# Altium project ESP32_CAN_V2.PrjPcb
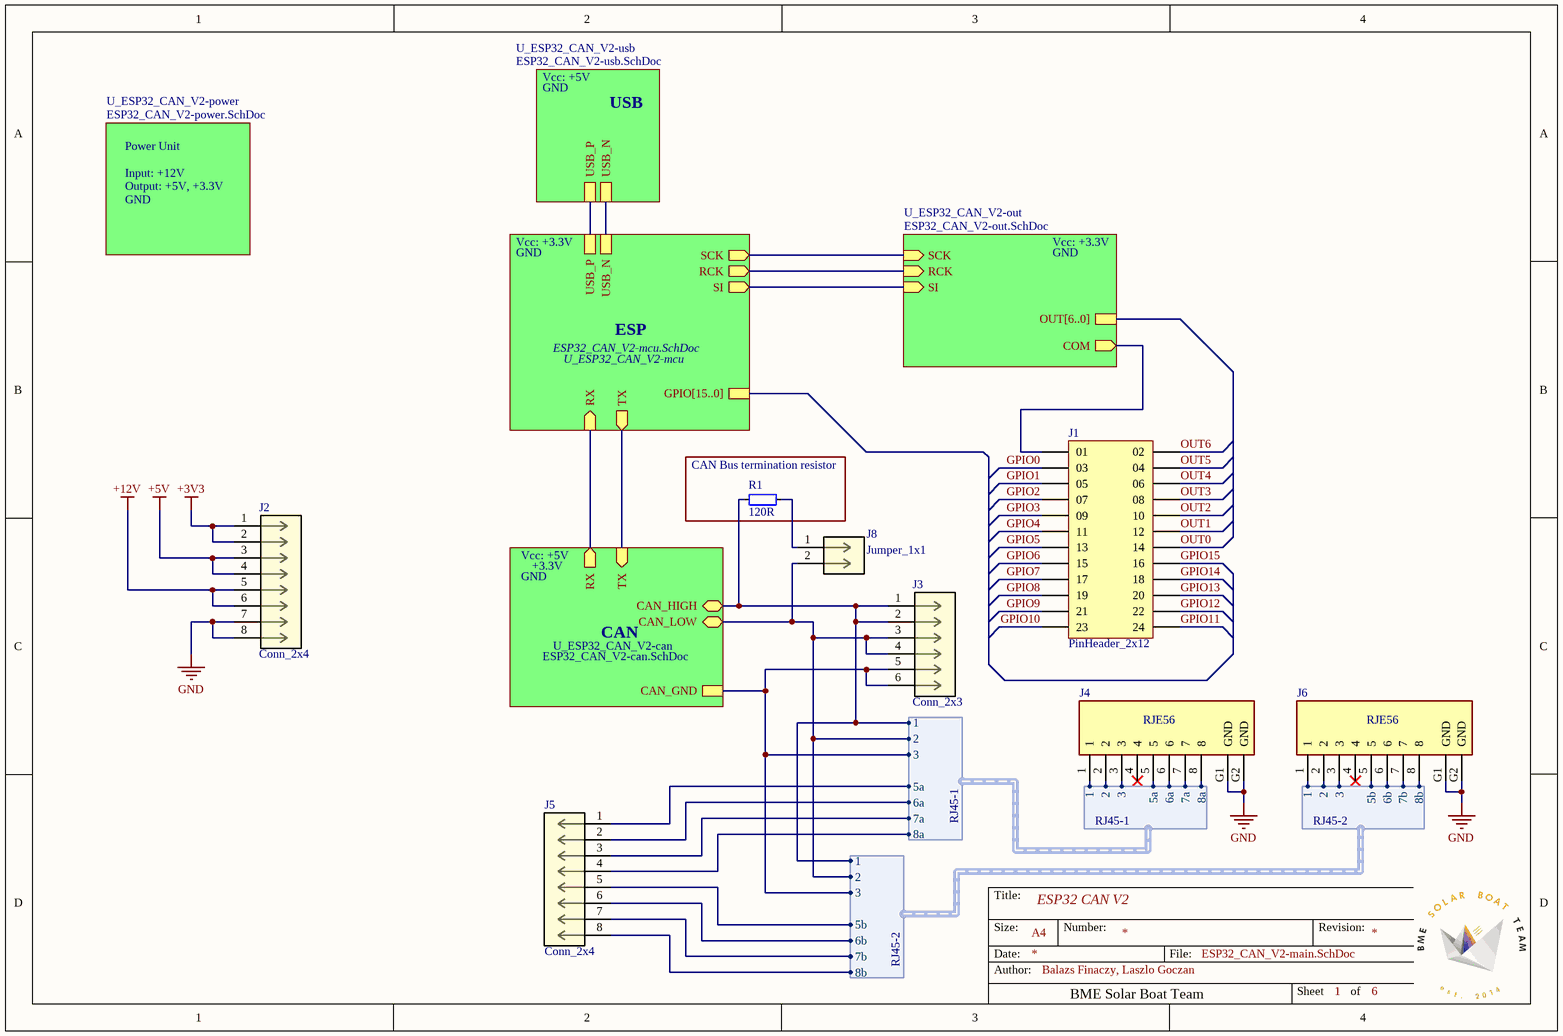
[diagram p0: ESP32_CAN_V2-main.SchDoc]
6 sheets, 87 parts. Net scope: hierarchical (ports join the sheet entries above them; power ports are global).
Board file: ESP32_CAN_V2.2.PcbDoc
Sheets:
  ESP32_CAN_V2-main.SchDoc
    U_ESP32_CAN_V2-mcu = ESP32_CAN_V2-mcu.SchDoc
    U_ESP32_CAN_V2-usb = ESP32_CAN_V2-usb.SchDoc
    U_ESP32_CAN_V2-out = ESP32_CAN_V2-out.SchDoc
    U_ESP32_CAN_V2-power = ESP32_CAN_V2-power.SchDoc
    U_ESP32_CAN_V2-can = ESP32_CAN_V2-can.SchDoc

## Sheet ESP32_CAN_V2-main.SchDoc: ESP32 CAN V2
size A4; DrawnBy: Balazs Finaczy, Laszlo Goczan; SheetNumber: 1; SheetTotal: 6

### Parts
J1  PinHeader_2x12  [AMPHENOL_10129381-924003BLF]
J2  Conn_2x4  [CONN_10129381-X08002XLF_AMP]
J3  Conn_2x3  [CONN_10129381-X08002XLF_AMP]
J4  RJE56  [AMPHENOL_RJE561881410]
J5  Conn_2x4  [CONN_10129381-X08002XLF_AMP]
J6  RJE56  [AMPHENOL_RJE561881410]
J8  Jumper_1x1  [CON2_1X2_TU_TSW]
R1  120R  [R0603]

### Blocks framed on the sheet
CAN Bus termination resistor: R1

### Sub-sheets
U_ESP32_CAN_V2-can = ESP32_CAN_V2-can.SchDoc: RX (out), TX (in), CAN_HIGH (bidir), CAN_LOW (bidir), CAN_GND
U_ESP32_CAN_V2-mcu = ESP32_CAN_V2-mcu.SchDoc: TX (out), RX (in), SCK (out), RCK (out), SI (out), GPIO[15..0], USB_N, USB_P
U_ESP32_CAN_V2-out = ESP32_CAN_V2-out.SchDoc: SI (in), RCK (in), SCK (in), COM (out), OUT[6..0]
U_ESP32_CAN_V2-power = ESP32_CAN_V2-power.SchDoc: no entries
U_ESP32_CAN_V2-usb = ESP32_CAN_V2-usb.SchDoc: USB_N, USB_P

### Harnesses
RJ45-1: 1, 2, 3, 5a, 6a, 7a, 8a
RJ45-2: 1, 2, 3, 5b, 6b, 7b, 8b

### Nets
+3V3: J2.1 J2.2
+5V: J2.3 J2.4
+12V: J2.5 J2.6
GND: J2.7 J2.8 J4.G1(GND) J4.G2(GND) J6.G1(GND) J6.G2(GND)
CAN_GND: J3.5 J3.6 J4.3 J6.3 ; sheet U_ESP32_CAN_V2-can/CAN_GND, harness RJ45-1.3, harness RJ45-2.3
GPIO0: J1.03  [project net GPIO0_1]
GPIO1: J1.05  [project net GPIO1_1]
GPIO2: J1.07  [project net GPIO2_1]
GPIO3: J1.09  [project net GPIO3_1]
GPIO4: J1.11  [project net GPIO4_1]
GPIO5: J1.13  [project net GPIO5_1]
GPIO6: J1.15  [project net GPIO6_1]
GPIO7: J1.17  [project net GPIO7_1]
GPIO8: J1.19  [project net GPIO8_1]
GPIO9: J1.21  [project net GPIO9_1]
GPIO10: J1.23  [project net GPIO10_1]
GPIO11: J1.24  [project net GPIO11_1]
GPIO12: J1.22  [project net GPIO12_1]
GPIO13: J1.20  [project net GPIO13_1]
GPIO14: J1.18  [project net GPIO14_1]
GPIO15: J1.16  [project net GPIO15_1]
OUT0: J1.14  [project net OUT0_1]
OUT1: J1.12  [project net OUT1_1]
OUT2: J1.10  [project net OUT2_1]
OUT3: J1.08  [project net OUT3_1]
OUT4: J1.06  [project net OUT4_1]
OUT5: J1.04  [project net OUT5_1]
OUT6: J1.02  [project net OUT6_1]
RCK: sheet U_ESP32_CAN_V2-mcu/RCK, sheet U_ESP32_CAN_V2-out/RCK
RX: sheet U_ESP32_CAN_V2-mcu/RX, sheet U_ESP32_CAN_V2-can/RX
SI: sheet U_ESP32_CAN_V2-mcu/SI, sheet U_ESP32_CAN_V2-out/SI
TX: sheet U_ESP32_CAN_V2-mcu/TX, sheet U_ESP32_CAN_V2-can/TX
USB_N: sheet U_ESP32_CAN_V2-mcu/USB_N, sheet U_ESP32_CAN_V2-usb/USB_N
USB_P: sheet U_ESP32_CAN_V2-mcu/USB_P, sheet U_ESP32_CAN_V2-usb/USB_P
NetC23_2: J3.1 J3.2 J4.1 J6.1 R1.1 ; sheet U_ESP32_CAN_V2-can/CAN_HIGH, harness RJ45-1.1, harness RJ45-2.1
NetC24_1: J3.3 J3.4 J4.2 J6.2 J8.2 ; sheet U_ESP32_CAN_V2-can/CAN_LOW, harness RJ45-1.2, harness RJ45-2.2
NetD3_1: J1.01 ; sheet U_ESP32_CAN_V2-out/COM
NetIC1_11: sheet U_ESP32_CAN_V2-mcu/SCK, sheet U_ESP32_CAN_V2-out/SCK
NetJ4_5: J4.5 J5.1 ; harness RJ45-1.5a
NetJ4_6: J4.6 J5.2 ; harness RJ45-1.6a
NetJ4_7: J4.7 J5.3 ; harness RJ45-1.7a
NetJ4_8: J4.8 J5.4 ; harness RJ45-1.8a
NetJ5_5: J5.5 J6.5 ; harness RJ45-2.5b
NetJ5_6: J5.6 J6.6 ; harness RJ45-2.6b
NetJ5_7: J5.7 J6.7 ; harness RJ45-2.7b
NetJ5_8: J5.8 J6.8 ; harness RJ45-2.8b
NetJ8_1: J8.1 R1.2

Not connected (* = marked no-connect by the designer): J4 4*; J6 4*

### Notes on the sheet
- Vcc: +5V
- GND
- USB
- Power Unit
- Input: +12V
- Output: +5V, +3.3V
- Vcc: +3.3V
- ESP
- +3.3V
- CAN
- Title:
- Size:
- Date:
- Author:
- A4
- Number:
- BME Solar Boat Team
- File:
- Revision:
- Sheet
- of

### Library data of the parts
J1 = PinHeader_2x12: MF: {'manufacturer': u'Amphenol ICC (FCI)'}; MP: 10129381-924003BLF; Package: None; Price: None; Value: *; Availability: Unavailable
J2 J5 = PinHeader_2x4: Manufacturer_Name: Amphenol ICC; Manufacturer_Part_Number: 10129381-908002BLF; Copyright: Copyright (C) 2026 Ultra Librarian. All rights reserved.; RefDes: RefDes; Type: Type
J3 = PinHeader_2x3_1: Manufacturer_Name: Amphenol ICC; Manufacturer_Part_Number: 10129381-908002BLF; Copyright: Copyright (C) 2026 Ultra Librarian. All rights reserved.; RefDes: RefDes; Type: Type
J4 J6 = RJE561881410: Modular Jack - Right Angle, Input Output Connectors 8P8C, Without Shield .; MF: Amphenol Commercial Products; Reference: RJE56-188-1410; SnapEDA_Link: https://www.snapeda.com/parts/RJE561881410/Amphenol/view-part/?ref=snap; Package: None; Value: *; MP: RJE561881410; Check_prices: https://www.snapeda.com/parts/RJE561881410/Amphenol/view-part/?ref=eda; Type: RJE56; Supplier: Farnell
J8 = TSW-102-08-T-S: No Description Available; Manufacturer_Name: Samtec Inc; Copyright: Copyright (C) 2026 Ultra Librarian. All rights reserved.; Manufacturer_Part_Number: TSW-102-08-T-S; RefDes: RefDes; Type: Type
R1 = R

## Sheet ESP32_CAN_V2-mcu.SchDoc: ESP32_CAN_V2 - ESP unit
size A4; DrawnBy: Balazs Finaczy, Laszlo Goczan; SheetNumber: 2; SheetTotal: 6
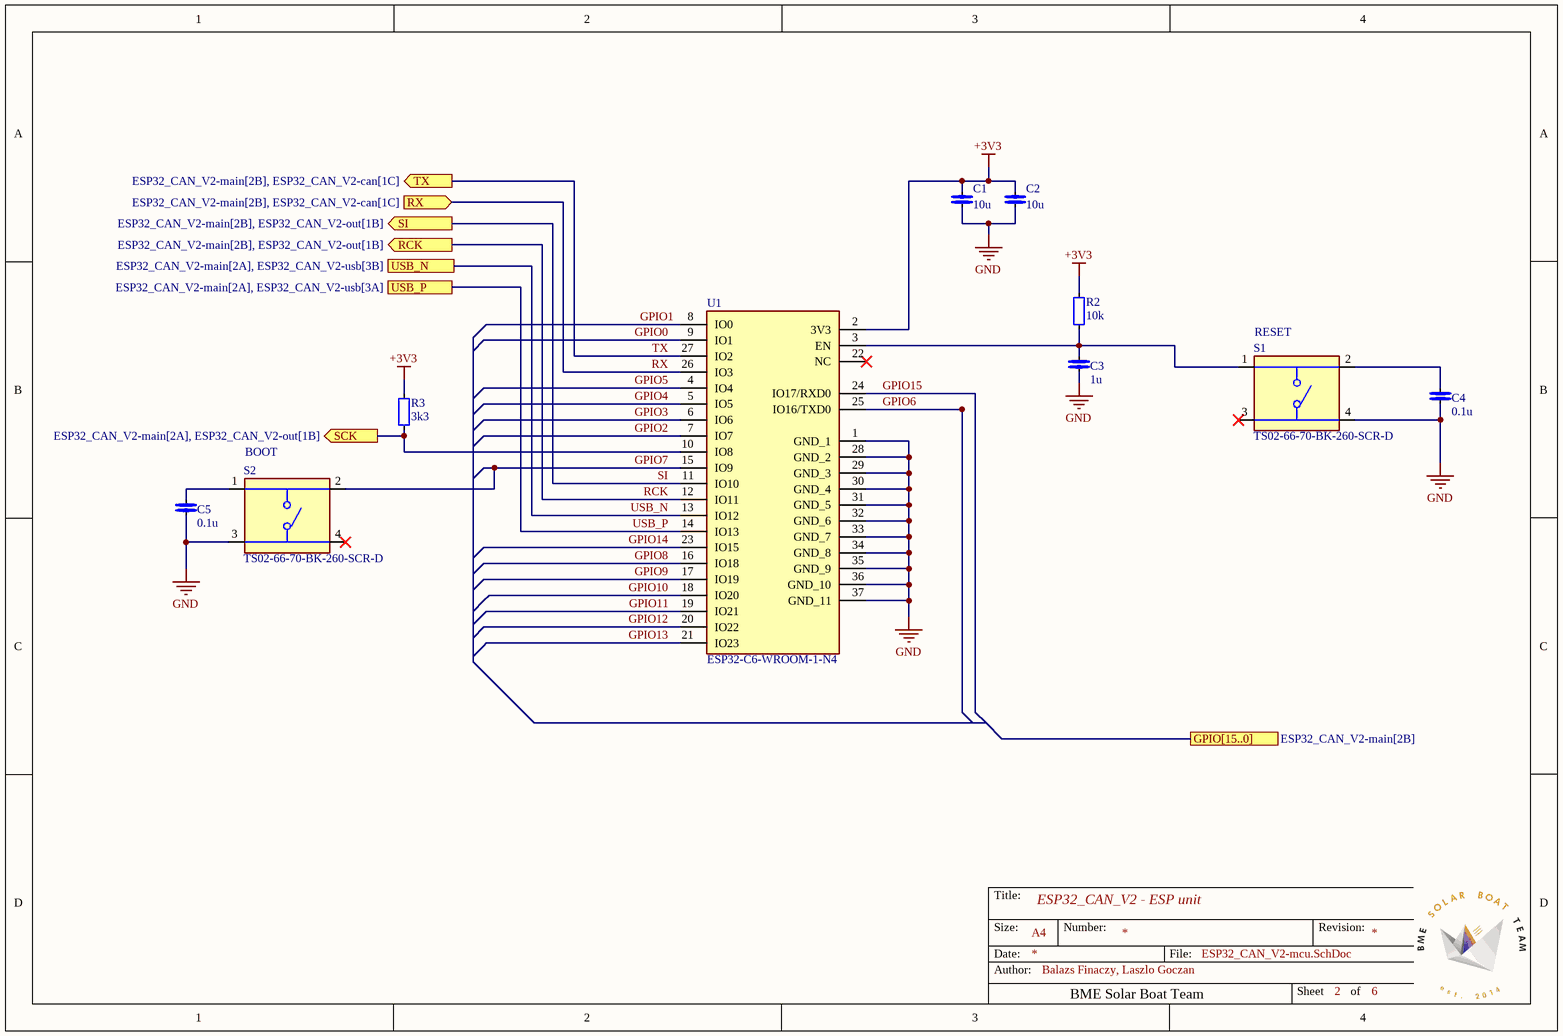
[diagram p1: ESP32_CAN_V2-mcu.SchDoc]

### Parts
C1  10u  [C0805]
C2  10u  [C0805]
C3  1u  [C0603]
C4  0.1u  [C0603]
C5  0.1u  [C0603]
R2  10k  [R0603]
R3  3k3  [R0603]
S1  TS02-66-70-BK-260-SCR-D  [SW_TS02-66-70-BK-260-SCR-D]
S2  TS02-66-70-BK-260-SCR-D  [SW_TS02-66-70-BK-260-SCR-D]
U1  ESP32-C6-WROOM-1-N4  [ESP32C6WROOM1N4]

### Ports
GPIO[15..0] (see ESP32_CAN_V2-main[2B]), RCK (out, see ESP32_CAN_V2-main[2B], ESP32_CAN_V2-out[1B]), RX (in, see ESP32_CAN_V2-main[2B], ESP32_CAN_V2-can[1C]), SCK (out, see ESP32_CAN_V2-main[2A], ESP32_CAN_V2-out[1B]), SI (out, see ESP32_CAN_V2-main[2B], ESP32_CAN_V2-out[1B]), TX (out, see ESP32_CAN_V2-main[2B], ESP32_CAN_V2-can[1C]), USB_N (see ESP32_CAN_V2-main[2A], ESP32_CAN_V2-usb[3B]), USB_P (see ESP32_CAN_V2-main[2A], ESP32_CAN_V2-usb[3A])

### Nets
+3V3: C1.2 C2.2 R2.2 R3.2 U1.2(3V3)
GND: C1.1 C2.1 C3.1 C4.1 C5.1 S1.4 S2.3 U1.1(GND_1) U1.28(GND_2) U1.29(GND_3) U1.30(GND_4) U1.31(GND_5) U1.32(GND_6) U1.33(GND_7) U1.34(GND_8) U1.35(GND_9) U1.36(GND_10) U1.37(GND_11)
GPIO0: U1.9(IO1)  [project net GPIO0_2]
GPIO1: U1.8(IO0)  [project net GPIO1_2]
GPIO2: U1.7(IO7)  [project net GPIO2_2]
GPIO3: U1.6(IO6)  [project net GPIO3_2]
GPIO4: U1.5(IO5)  [project net GPIO4_2]
GPIO5: U1.4(IO4)  [project net GPIO5_2]
GPIO6: U1.25(IO16/TXD0)  [project net GPIO6_2]
GPIO7: S2.2 U1.15(IO9)  [project net GPIO7_2]
GPIO8: U1.16(IO18)  [project net GPIO8_2]
GPIO9: U1.17(IO19)  [project net GPIO9_2]
GPIO10: U1.18(IO20)  [project net GPIO10_2]
GPIO11: U1.19(IO21)  [project net GPIO11_2]
GPIO12: U1.20(IO22)  [project net GPIO12_2]
GPIO13: U1.21(IO23)  [project net GPIO13_2]
GPIO14: U1.23(IO15)  [project net GPIO14_2]
GPIO15: U1.24(IO17/RXD0)  [project net GPIO15_2]
RCK: U1.12(IO11) ; port RCK
RX: U1.26(IO3) ; port RX
SI: U1.11(IO10) ; port SI
TX: U1.27(IO2) ; port TX
USB_N: U1.13(IO12) ; port USB_N
USB_P: U1.14(IO13) ; port USB_P
NetC3_2: C3.2 R2.1 S1.1 U1.3(EN)
NetC4_2: C4.2 S1.2
NetC5_2: C5.2 S2.1
NetIC1_11: R3.1 U1.10(IO8) ; port SCK

Not connected (* = marked no-connect by the designer): S1 3*; S2 4*; U1 22(NC)*

### Notes on the sheet
- (near S1) RESET
- (near S2) BOOT
- Title:
- Size:
- Date:
- Author:
- A4
- Number:
- BME Solar Boat Team
- File:
- Revision:
- Sheet
- of

### Library data of the parts
C1-C5 = C
R2 R3 = R
S1 S2 = TS02-66-70-BK-260-SCR-D: 6 x 6 mm, 7 mm Actuator Height, 260 gf, Black, Short Crimped, Through Hole, SPST, Tactile Switch; MF: Same Sky; SnapEDA_Link: https://www.snapeda.com/parts/TS02-66-70-BK-260-SCR-D/Same+Sky/view-part/?ref=snap; Package: None; Value: *; MP: TS02-66-70-BK-260-SCR-D; Check_prices: https://www.snapeda.com/parts/TS02-66-70-BK-260-SCR-D/Same+Sky/view-part/?ref=eda
U1 = ESP32-C6-WROOM-1-N4_reorder: 802.15.4, Bluetooth, WiFi Bluetooth v5.0, Zigbee Transceiver Module 2.4GHz PCB Trace Surface Mount; Manufacturer_Name: Espressif Systems; Geometry.Height: 3.25mm; Mouser Part Number: 356-ESP32C6WROOM1N4; Mouser Price/Stock: https://www.mouser.co.uk/ProductDetail/Espressif-Systems/ESP32-C6-WROOM-1-N4?qs=8Wlm6%252BaMh8R1JRAtXlt87w%3D%3D; Manufacturer_Part_Number: ESP32-C6-WROOM-1-N4; Datasheet Link: https://www.espressif.com/sites/default/files/documentation/esp32-c6-wroom-1_wroom-1u_datasheet_en.pdf

## Sheet ESP32_CAN_V2-usb.SchDoc: ESP32_CAN_V2 - USB unit
size A4; DrawnBy: Balazs Finaczy, Laszlo Goczan; SheetNumber: 3; SheetTotal: 6
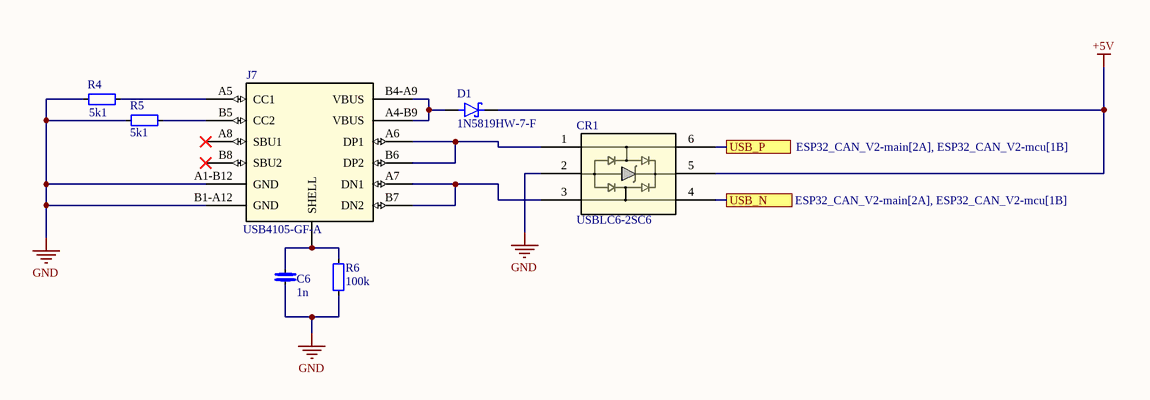
[diagram p2: ESP32_CAN_V2-usb.SchDoc]

### Parts
C6  1n  [C0603]
CR1  USBLC6-2SC6  [SOT23-6L_STM]
D1  1N5819HW-7-F  [SOD3715X145N]
J7  USB4105-GF-A  [USB4105_GCT]
R4  5k1  [R0603]
R5  5k1  [R0603]
R6  100k  [R0603]

### Ports
USB_N (see ESP32_CAN_V2-main[2A], ESP32_CAN_V2-mcu[1B]), USB_P (see ESP32_CAN_V2-main[2A], ESP32_CAN_V2-mcu[1B])

### Nets
+5V: CR1.5 D1.C(K)
GND: C6.1 CR1.2 J7.A1-B12(GND) J7.B1-A12(GND) R4.1 R5.1 R6.1
USB_N: CR1.4 ; port USB_N
USB_P: CR1.6 ; port USB_P
NetC6_2: C6.2 J7.SHELL R6.2
NetCR1_1: CR1.1 J7.A6(DP1) J7.B6(DP2)
NetCR1_3: CR1.3 J7.A7(DN1) J7.B7(DN2)
NetD1_A: D1.A J7.A4-B9(VBUS) J7.B4-A9(VBUS)
NetJ7_A5: J7.A5(CC1) R4.2
NetJ7_B5: J7.B5(CC2) R5.2

Not connected (* = marked no-connect by the designer): J7 A8(SBU1)* B8(SBU2)*

### Notes on the sheet
- Title:
- Size:
- Date:
- Author:
- A4
- Number:
- BME Solar Boat Team
- File:
- Revision:
- Sheet
- of

### Library data of the parts
C6 = C
CR1 = USBLC6-2SC6: ESD Protection for USB 2.0 High Speed; Manufacturer_Name: STMicroelectronics; Copyright: Copyright (C) 2025 Ultra Librarian. All rights reserved.; Manufacturer_Part_Number: USBLC6-2SC6; RefDes: RefDes; Type: Type
D1 = 1N5819HW-7-F: Diode Schottky 40 V 1A Surface Mount SOD-123; MF: Diodes Inc.; Value: *; SnapEDA_Link: https://www.snapeda.com/parts/1N5819HW-7-F/Diodes+Inc./view-part/?ref=snap; Purchase-URL: https://pricing.snapeda.com/search/part/1N5819HW-7-F/?ref=eda; Availability: In Stock; Price: None; Package: SOD-123 Fairchild Semiconductor; Check_prices: https://www.snapeda.com/parts/1N5819HW-7-F/Diodes+Inc./view-part/?ref=eda; MP: 1N5819HW-7-F
J7 = USB4105-GF-A: Description; Manufacturer_Name: Global Connector Technology; Copyright: Copyright (C) 2025 Ultra Librarian. All rights reserved.; Manufacturer_Part_Number: USB4105-GF-A; RefDes: RefDes; Type: Type
R4-R6 = R

## Sheet ESP32_CAN_V2-out.SchDoc: ESP32_CAN_V2 - OUT module
size A4; DrawnBy: Balazs Finaczy, Laszlo Goczan; SheetNumber: 4; SheetTotal: 6
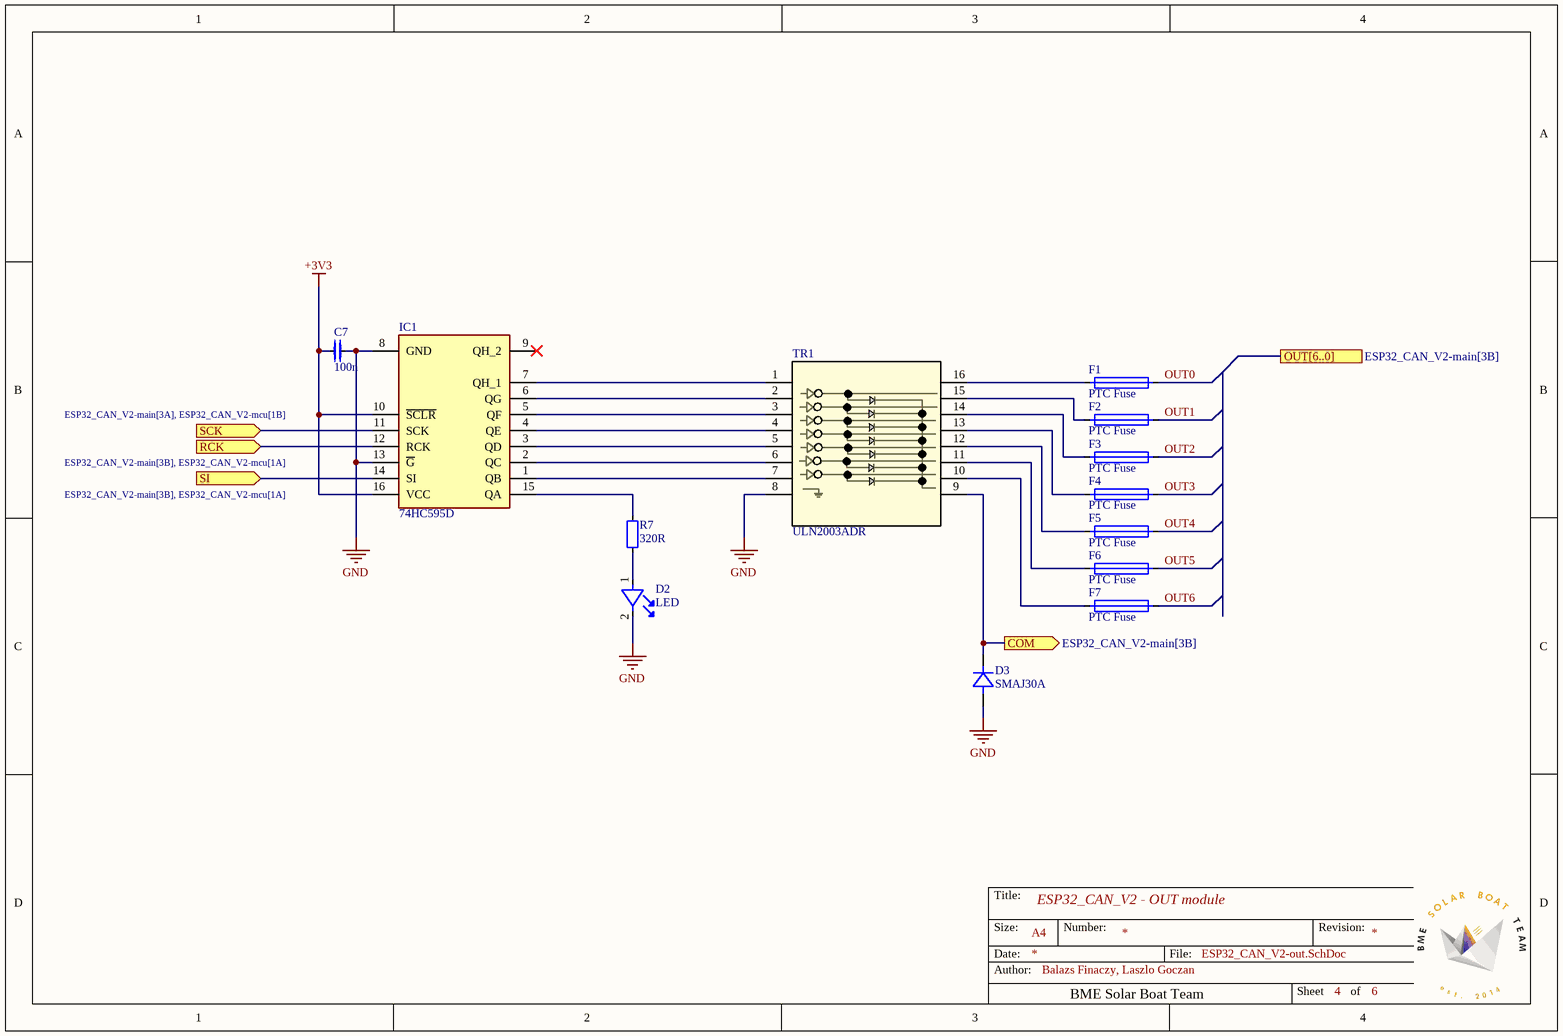
[diagram p3: ESP32_CAN_V2-out.SchDoc]

### Parts
C7  100n  [C0603]
D2  LED  [LED]
D3  SMAJ30A  [SMASeries_LTF]
F1  PTC Fuse  [PTSAHT120624V050]
F2  PTC Fuse  [PTSAHT120624V050]
F3  PTC Fuse  [PTSAHT120624V050]
F4  PTC Fuse  [PTSAHT120624V050]
F5  PTC Fuse  [PTSAHT120624V050]
F6  PTC Fuse  [PTSAHT120624V050]
F7  PTC Fuse  [PTSAHT120624V050]
IC1  74HC595D  [SOIC127P600X175-16N]
R7  320R  [R0603]
TR1  ULN2003ADR  [ULN2003ADR2G_OSI]

### Ports
COM (out, see ESP32_CAN_V2-main[3B]), OUT[6..0] (see ESP32_CAN_V2-main[3B]), RCK (in, see ESP32_CAN_V2-main[3B], ESP32_CAN_V2-mcu[1A]), SCK (in, see ESP32_CAN_V2-main[3A], ESP32_CAN_V2-mcu[1B]), SI (in, see ESP32_CAN_V2-main[3B], ESP32_CAN_V2-mcu[1A])

### Nets
+3V3: C7.1 IC1.10(~{SCLR}) IC1.16(VCC)
GND: C7.2 D2.2 D3.2 IC1.8(GND) IC1.13(~{G}) TR1.8
OUT0: F1.2  [project net OUT0_4]
OUT1: F2.2  [project net OUT1_4]
OUT2: F3.2  [project net OUT2_4]
OUT3: F4.2  [project net OUT3_4]
OUT4: F5.2  [project net OUT4_4]
OUT5: F6.2  [project net OUT5_4]
OUT6: F7.2  [project net OUT6_4]
RCK: IC1.12(RCK) ; port RCK
SI: IC1.14(SI) ; port SI
NetD2_1: D2.1 R7.2
NetD3_1: D3.1 TR1.9 ; port COM
NetF1_1: F1.1 TR1.16
NetF2_1: F2.1 TR1.15
NetF3_1: F3.1 TR1.14
NetF4_1: F4.1 TR1.13
NetF5_1: F5.1 TR1.12
NetF6_1: F6.1 TR1.11
NetF7_1: F7.1 TR1.10
NetIC1_1: IC1.1(QB) TR1.7
NetIC1_2: IC1.2(QC) TR1.6
NetIC1_3: IC1.3(QD) TR1.5
NetIC1_4: IC1.4(QE) TR1.4
NetIC1_5: IC1.5(QF) TR1.3
NetIC1_6: IC1.6(QG) TR1.2
NetIC1_7: IC1.7(QH_1) TR1.1
NetIC1_11: IC1.11(SCK) ; port SCK
NetIC1_15: IC1.15(QA) R7.1

Not connected (* = marked no-connect by the designer): IC1 9(QH_2)*

### Notes on the sheet
- Title:
- Size:
- Date:
- Author:
- A4
- Number:
- BME Solar Boat Team
- File:
- Revision:
- Sheet
- of

### Library data of the parts
C7 = C
D2 = LED: 150060BS83000
D3 = SMAJ30A: No Description Available; Manufacturer_Name: Littelfuse Inc; Copyright: Copyright (C) 2026 Ultra Librarian. All rights reserved.; Manufacturer_Part_Number: SMAJ30A
F1-F7 = PTC Fuse: PTSAHT1206
IC1 = 74HC595D: Shift Register Single 8-Bit Serial to Serial/Parallel 16-Pin SOIC T/R; Manufacturer_Name: Toshiba; Geometry.Height: 1.75mm; Mouser Part Number: 757-74HC595D; Mouser Price/Stock: https://www.mouser.co.uk/ProductDetail/Toshiba/74HC595D?qs=7EBvPakHacViJoQmXKcnew%3D%3D; Manufacturer_Part_Number: 74HC595D; Datasheet Link: https://toshiba.semicon-storage.com/info/docget.jsp?did=36768&prodName=74HC595D
R7 = R
TR1 = ULN2003ADR2G: No Description Available; Manufacturer_Name: onsemi; Copyright: Copyright (C) 2026 Ultra Librarian. All rights reserved.; Manufacturer_Part_Number: ULN2003ADR2G; RefDes: RefDes; Type: Type

## Sheet ESP32_CAN_V2-power.SchDoc: ESP32_CAN_V2 - Power unit
size A4; DrawnBy: Balazs Finaczy, Laszlo Goczan; SheetNumber: 5; SheetTotal: 6
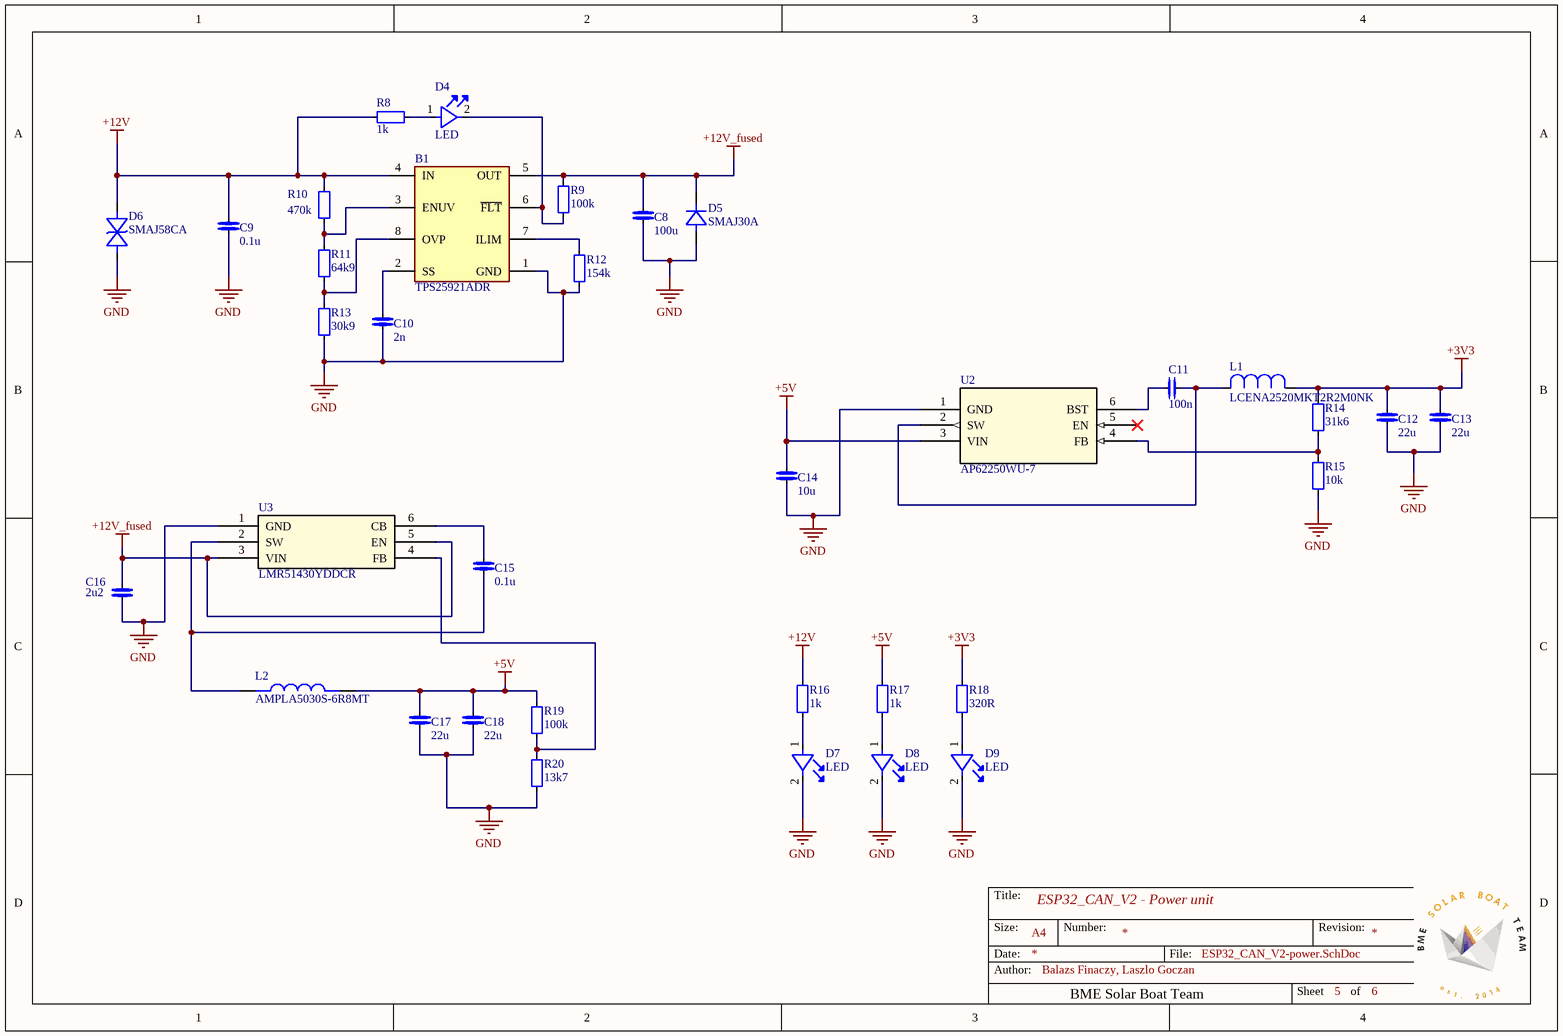
[diagram p4: ESP32_CAN_V2-power.SchDoc]

### Parts
B1  TPS25921ADR  [SOIC127P600X175-8N]
C8  100u  [C1206]
C9  0.1u  [C0603]
C10  2n  [C0603]
C11  100n  [C0603]
C12  22u  [C0805]
C13  22u  [C0805]
C14  10u  [C0805]
C15  0.1u  [C0603]
C16  2u2  [C0805]
C17  22u  [C0805]
C18  22u  [C0805]
D4  LED  [LED]
D5  SMAJ30A  [SMASeries_LTF]
D6  SMAJ58CA  [SMASeries_LTF]
D7  LED  [LED]
D8  LED  [LED]
D9  LED  [LED]
L1  LCENA2520MKT2R2M0NK  [IND_LCEN_2520MK_TAY]
L2  AMPLA5030S-6R8MT  [IND_AMPLA5030S-6R8MT]
R8  1k  [R0603]
R9  100k  [R0603]
R10  470k  [R0603]
R11  64k9  [R0603]
R12  154k  [R0603]
R13  30k9  [R0603]
R14  31k6  [R0603]
R15  10k  [R0603]
R16  1k  [R0603]
R17  1k  [R0603]
R18  320R  [R0603]
R19  100k  [R0603]
R20  13k7  [R0603]
U2  AP62250WU-7  [TSOT26STANDARD_DIO]
U3  LMR51430YDDCR  [SOT-23-THIN-6_DDC_TEX]

### Nets
+3V3: C12.2 C13.2 L1.1 R14.2 R18.2
+5V: C14.2 C17.2 C18.2 L2.2 R17.2 R19.2 U2.3(VIN)
+12V: B1.4(IN) C9.2 D6.1 R8.2 R10.2 R16.2
+12V_fused: B1.5(OUT) C8.2 C16.2 D5.1 R9.2 U3.3(VIN) U3.5(EN)
GND: B1.1(GND) C8.1 C9.1 C10.1 C12.1 C13.1 C14.1 C16.1 C17.1 C18.1 D5.2 D6.2 D7.2 D8.2 D9.2 R12.1 R13.1 R15.1 R20.1 U2.1(GND) U3.1(GND)
NetB1_2: B1.2(SS) C10.2
NetB1_3: B1.3(ENUV) R10.1 R11.2
NetB1_6: B1.6(~{FLT}) D4.2 R9.1
NetB1_7: B1.7(ILIM) R12.2
NetB1_8: B1.8(OVP) R11.1 R13.2
NetC11_1: C11.1 U2.6(BST)
NetC11_2: C11.2 L1.2 U2.2(SW)
NetC15_1: C15.1 L2.1 U3.2(SW)
NetC15_2: C15.2 U3.6(CB)
NetD4_1: D4.1 R8.1
NetD7_1: D7.1 R16.1
NetD8_1: D8.1 R17.1
NetD9_1: D9.1 R18.1
NetR14_1: R14.1 R15.2 U2.4(FB)
NetR19_1: R19.1 R20.2 U3.4(FB)

Not connected (* = marked no-connect by the designer): U2 5(EN)*

### Notes on the sheet
- Title:
- Size:
- Date:
- Author:
- A4
- Number:
- BME Solar Boat Team
- File:
- Revision:
- Sheet
- of

### Library data of the parts
B1 = TPS25921ADR: 18V, 1.6A, 90m eFuse with Adjustable +/-2% Accurate Current Limit; Manufacturer_Name: Texas Instruments; Geometry.Height: 1.75mm; Mouser Part Number: 595-TPS25921ADR; Mouser Price/Stock: https://www.mouser.co.uk/ProductDetail/Texas-Instruments/TPS25921ADR?qs=m%2F7bTylgptfvwfVPRm0ALQ%3D%3D; Manufacturer_Part_Number: TPS25921ADR; Datasheet Link: http://www.ti.com/lit/gpn/tps25921a
C8-C18 = C
D4 = LED: 150060RS83000
D5 = SMAJ30A: as D3 on sheet ESP32_CAN_V2-out; Copyright: Copyright (C) 2026 Ultra Librarian. All rights reserved.; Manufacturer_Part_Number: SMAJ30A
D6 = SMAJ58CA: No Description Available; Manufacturer_Name: Littelfuse Inc; Copyright: Copyright (C) 2026 Ultra Librarian. All rights reserved.; Manufacturer_Part_Number: SMAJ58CA
D7 = LED: 150060AS83000; Manufacturer_Part_Number: 710-150060AS83000
D8 = LED: 150060YS83000; Manufacturer_Part_Number: 710-150060YS83000
D9 = LED: 150060VS83000; Manufacturer_Part_Number: 710-150060VS83000
L1 = L: No Description Available; Manufacturer_Name: TAIYO YUDEN; Copyright: Copyright (C) 2026 Ultra Librarian. All rights reserved.; Manufacturer_Part_Number: LCENA2520MKT2R2M0NK
L2 = AMPLA5030S-6R8MT: Inductor Power Shielded/Molded Wirewound 6.8uH 20% 100KHz Carbonyl Powder 4A 0.0762Ohm DCR 2220 T/R; MF: Abracon LLC; Package: Package; Price: None; Value: *; SnapEDA_Link: https://www.snapeda.com/parts/AMPLA5030S-6R8MT/Abracon+LLC/view-part/?ref=snap; MP: AMPLA5030S-6R8MT; Availability: Unavailable; Check_prices: https://www.snapeda.com/parts/AMPLA5030S-6R8MT/Abracon+LLC/view-part/?ref=eda
R8-R20 = R
U2 = AP62250WU-7: No Description Available; Manufacturer_Name: Diodes Inc; Copyright: Copyright (C) 2026 Ultra Librarian. All rights reserved.; Manufacturer_Part_Number: AP62250WU-7; RefDes: RefDes; Type: Type
U3 = LMR51430YDDCR: SIMPLE SWITCHER&reg; 4.5-V to 36-V, 3-A synchronous buck converter with 40-&micro;A IQ 6-SOT-23-THIN -40 to 150; Manufacturer_Name: Texas Instruments; Copyright: Copyright (C) 2025 Ultra Librarian. All rights reserved.; Manufacturer_Part_Number: LMR51430YDDCR; RefDes: RefDes; Type: Type

## Sheet ESP32_CAN_V2-can.SchDoc: ESP32_CAN_V2 - CAN coupling
size A4; DrawnBy: Balazs Finaczy, Laszlo Goczan; SheetNumber: 6; SheetTotal: 6
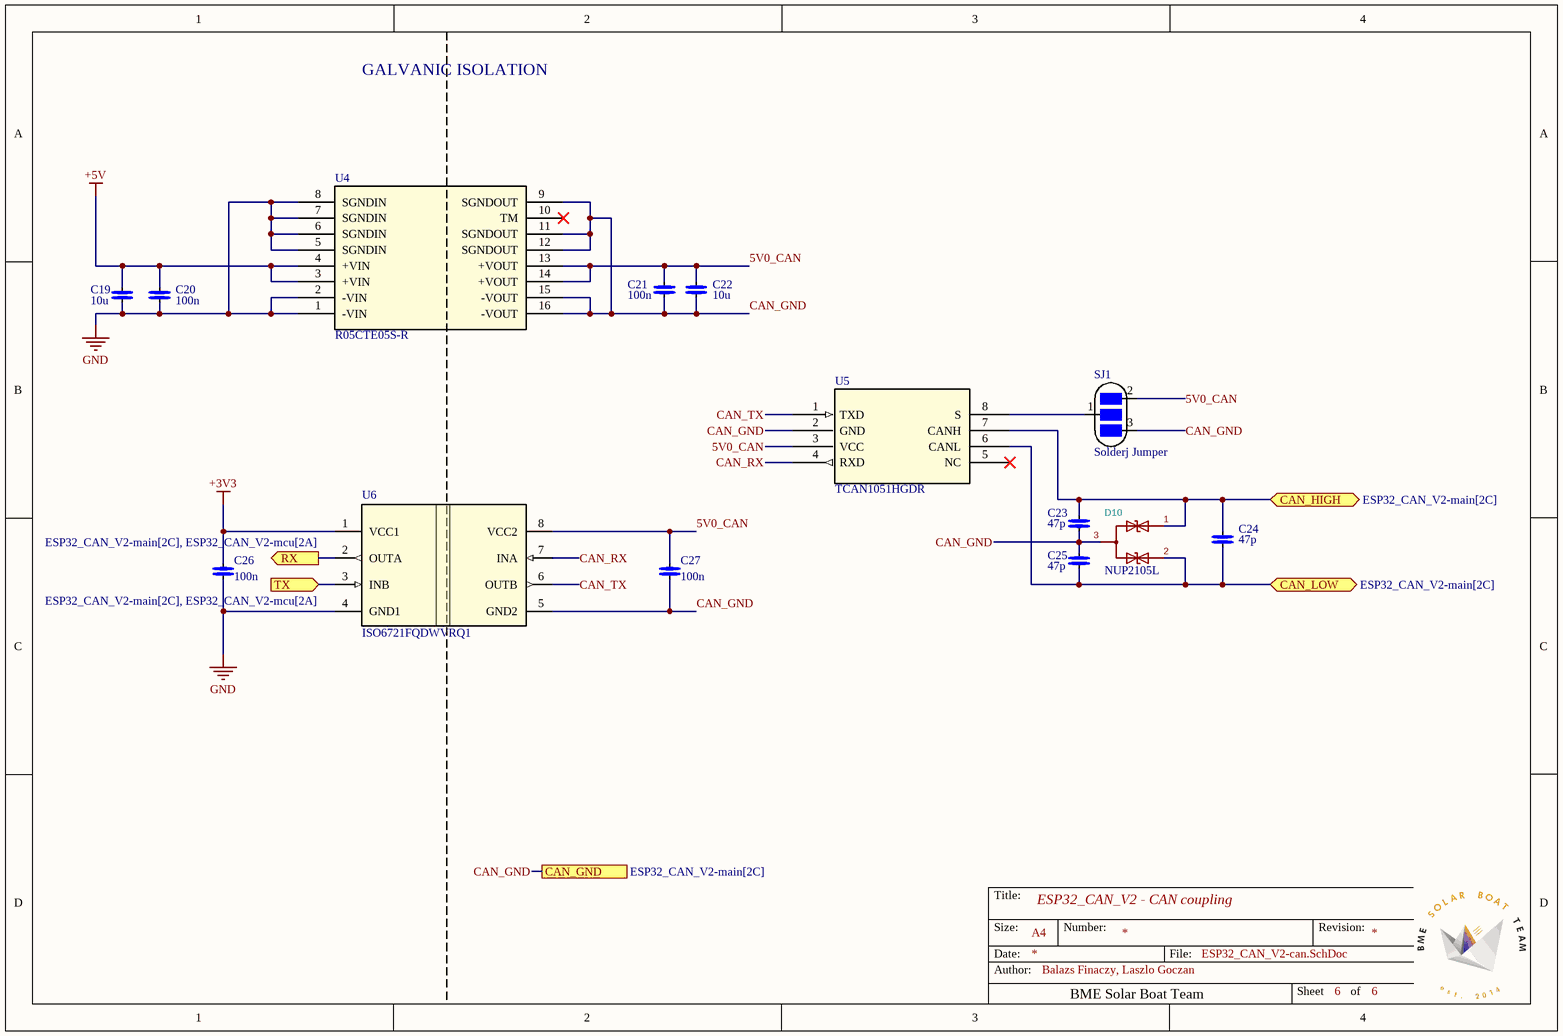
[diagram p5: ESP32_CAN_V2-can.SchDoc]

### Parts
C19  10u  [C0805]
C20  100n  [C0603]
C21  100n  [C0603]
C22  10u  [C0805]
C23  47p  [C0603]
C24  47p  [C0603]
C25  47p  [C0603]
C26  100n  [C0603]
C27  100n  [C0603]
D10  NUP2105L  [SOT-23]
SJ1  Solderj Jumper  [SolderJumper 1x2]
U4  R05CTE05S-R  [SMD_16_10.35X7.5X2.5_RCP]
U5  TCAN1051HGDR  [D8_TEX]
U6  ISO6721FQDWVRQ1  [DWV0008A-IPC_A]

### Ports
CAN_GND (see ESP32_CAN_V2-main[2C]), CAN_HIGH (bidir, see ESP32_CAN_V2-main[2C]), CAN_LOW (bidir, see ESP32_CAN_V2-main[2C]), RX (out, see ESP32_CAN_V2-main[2C], ESP32_CAN_V2-mcu[2A]), TX (in, see ESP32_CAN_V2-main[2C], ESP32_CAN_V2-mcu[2A])

### Nets
+3V3: C26.2 U6.1(VCC1)
+5V: C19.2 C20.2 U4.3(+VIN) U4.4(+VIN)
GND: C19.1 C20.1 C26.1 U4.1(-VIN) U4.2(-VIN) U4.5(SGNDIN) U4.6(SGNDIN) U4.7(SGNDIN) U4.8(SGNDIN) U6.4(GND1)
5V0_CAN: C21.2 C22.2 C27.2 SJ1.2 U4.13(+VOUT) U4.14(+VOUT) U5.3(VCC) U6.8(VCC2)  [project net 5V0_CAN_6]
CAN_GND: C21.1 C22.1 C23.1 C25.2 C27.1 D10.3 SJ1.3 U4.9(SGNDOUT) U4.11(SGNDOUT) U4.12(SGNDOUT) U4.15(-VOUT) U4.16(-VOUT) U5.2(GND) U6.5(GND2) ; port CAN_GND
CAN_RX: U5.4(RXD) U6.7(INA)  [project net CAN_RX_6]
CAN_TX: U5.1(TXD) U6.6(OUTB)  [project net CAN_TX_6]
RX: U6.2(OUTA) ; port RX
TX: U6.3(INB) ; port TX
NetC23_2: C23.2 C24.2 D10.1 U5.7(CANH) ; port CAN_HIGH
NetC24_1: C24.1 C25.1 D10.2 U5.6(CANL) ; port CAN_LOW
NetSJ1_1: SJ1.1 U5.8(S)

Not connected (* = marked no-connect by the designer): U4 10(TM)*; U5 5(NC)*

### Notes on the sheet
- GALVANIC ISOLATION
- Title:
- Size:
- Date:
- Author:
- A4
- Number:
- BME Solar Boat Team
- File:
- Revision:
- Sheet
- of

### Library data of the parts
C19-C27 = C
D10 = TVS-Bidirectional-Diode_Dual: ki_keywords: TVS Dual Diode; ki_description: TVS Dual Diode
SJ1 = Solder Jumper 1x2
U4 = R05CTE05S-R: DC/DC converter; Manufacturer_Name: Recom Power; Copyright: Copyright (C) 2026 Ultra Librarian. All rights reserved.; Manufacturer_Part_Number: R05CTE05S-R; RefDes: RefDes; Type: Type
U5 = TCAN1051HGDR: Fault Protected CAN Transceiver With Flexible Data-Rate 8-SOIC -55 to 125; Manufacturer_Name: Texas Instruments; Copyright: Copyright (C) 2026 Ultra Librarian. All rights reserved.; Manufacturer_Part_Number: TCAN1051HGDR; Datasheet: https://www.ti.com/lit/gpn/tcan1051hg; RefDes: RefDes; Type: Type
U6 = ISO6721FQDWVRQ1: Automotive, general-purpose, dual-channel, 1/1 digital isolator 8-SOIC -40 to 125; Manufacturer_Name: Texas Instruments; TYPE: TYPE; RefDes: RefDes; Copyright: Copyright (C) 2026 Ultra Librarian. All rights reserved.; Manufacturer_Part_Number: ISO6721FQDWVRQ1; Datasheet: https://www.ti.com/lit/gpn/iso6721-q1

## Nets that join several sheets
+3V3: ESP32_CAN_V2-main (J2.1 J2.2), ESP32_CAN_V2-mcu (5 pins), ESP32_CAN_V2-out (C7.1 IC1.10 IC1.16), ESP32_CAN_V2-power (5 pins), ESP32_CAN_V2-can (C26.2 U6.1)
+5V: ESP32_CAN_V2-main (J2.3 J2.4), ESP32_CAN_V2-usb (CR1.5 D1.C), ESP32_CAN_V2-power (7 pins), ESP32_CAN_V2-can (C19.2 C20.2 U4.3 U4.4)
+12V: ESP32_CAN_V2-main (J2.5 J2.6), ESP32_CAN_V2-power (6 pins)
GND: ESP32_CAN_V2-main (6 pins), ESP32_CAN_V2-mcu (18 pins), ESP32_CAN_V2-usb (7 pins), ESP32_CAN_V2-out (6 pins), ESP32_CAN_V2-power (21 pins), ESP32_CAN_V2-can (10 pins)
CAN_GND: ESP32_CAN_V2-main (J3.5 J3.6 J4.3 J6.3), ESP32_CAN_V2-can (14 pins)
NetC23_2: ESP32_CAN_V2-main (5 pins), ESP32_CAN_V2-can (C23.2 C24.2 D10.1 U5.7)
NetC24_1: ESP32_CAN_V2-main (5 pins), ESP32_CAN_V2-can (C24.1 C25.1 D10.2 U5.6)
NetD3_1: ESP32_CAN_V2-main (J1.01), ESP32_CAN_V2-out (D3.1 TR1.9)
NetIC1_11: ESP32_CAN_V2-mcu (R3.1 U1.10), ESP32_CAN_V2-out (IC1.11)
RCK: ESP32_CAN_V2-mcu (U1.12), ESP32_CAN_V2-out (IC1.12)
RX: ESP32_CAN_V2-mcu (U1.26), ESP32_CAN_V2-can (U6.2)
SI: ESP32_CAN_V2-mcu (U1.11), ESP32_CAN_V2-out (IC1.14)
TX: ESP32_CAN_V2-mcu (U1.27), ESP32_CAN_V2-can (U6.3)
USB_N: ESP32_CAN_V2-mcu (U1.13), ESP32_CAN_V2-usb (CR1.4)
USB_P: ESP32_CAN_V2-mcu (U1.14), ESP32_CAN_V2-usb (CR1.6)